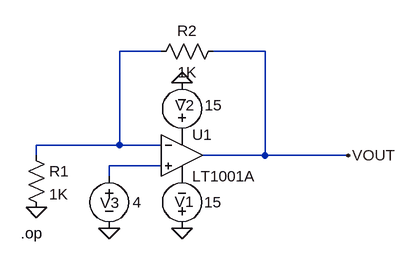
[diagram p0: schematic Non-Inverting Amplifier.asc]
Non-Inverting Amplifier.asc, the LTspice schematic file:
Version 4
SHEET 1 880 680
WIRE 160 16 96 16
WIRE 320 16 240 16
WIRE 96 160 96 16
WIRE 96 160 -32 160
WIRE 160 160 96 160
WIRE -32 176 -32 160
WIRE 320 176 320 16
WIRE 320 176 224 176
WIRE 448 176 320 176
WIRE 160 192 80 192
WIRE 80 208 80 192
FLAG 192 64 0
FLAG 192 288 0
FLAG 80 288 0
FLAG -32 256 0
FLAG 448 176 VOUT
SYMBOL OpAmps\\LT1001A 192 112 R0
SYMATTR InstName U1
SYMBOL voltage 192 304 R180
WINDOW 0 -18 57 Left 2
WINDOW 3 -61 56 Left 2
WINDOW 123 0 0 Left 0
WINDOW 39 0 0 Left 0
SYMATTR InstName V1
SYMATTR Value 15
SYMBOL voltage 192 160 R180
WINDOW 0 -19 61 Left 2
WINDOW 3 -62 61 Left 2
WINDOW 123 0 0 Left 0
WINDOW 39 0 0 Left 0
SYMATTR InstName V2
SYMATTR Value 15
SYMBOL voltage 80 192 R0
WINDOW 0 -14 57 Left 2
WINDOW 3 36 56 Left 2
WINDOW 123 0 0 Left 0
WINDOW 39 0 0 Left 0
SYMATTR InstName V3
SYMATTR Value 4
SYMBOL res -48 160 R0
SYMATTR InstName R1
SYMATTR Value 1K
SYMBOL res 256 0 R90
WINDOW 0 0 56 VBottom 2
WINDOW 3 32 56 VTop 2
SYMATTR InstName R2
SYMATTR Value 1K
TEXT -56 296 Left 2 !.op

The netlist it stands for:
* Non-Inverting Amplifier.asc
XU1 N002 N001 P001 P002 VOUT LT1001  ; LT1001A, pins In+ In- V+ V- OUT
V1 0 P002 15
V2 P001 0 15
V3 N002 0 4
R1 N001 0 1K
R2 VOUT N001 1K
.op
.lib LTC.lib
.backanno
.end